# Altium schematic sheet VOLTAGE REGULATOR.SchDoc
size A4; SheetNumber: 5; SheetTotal: 8
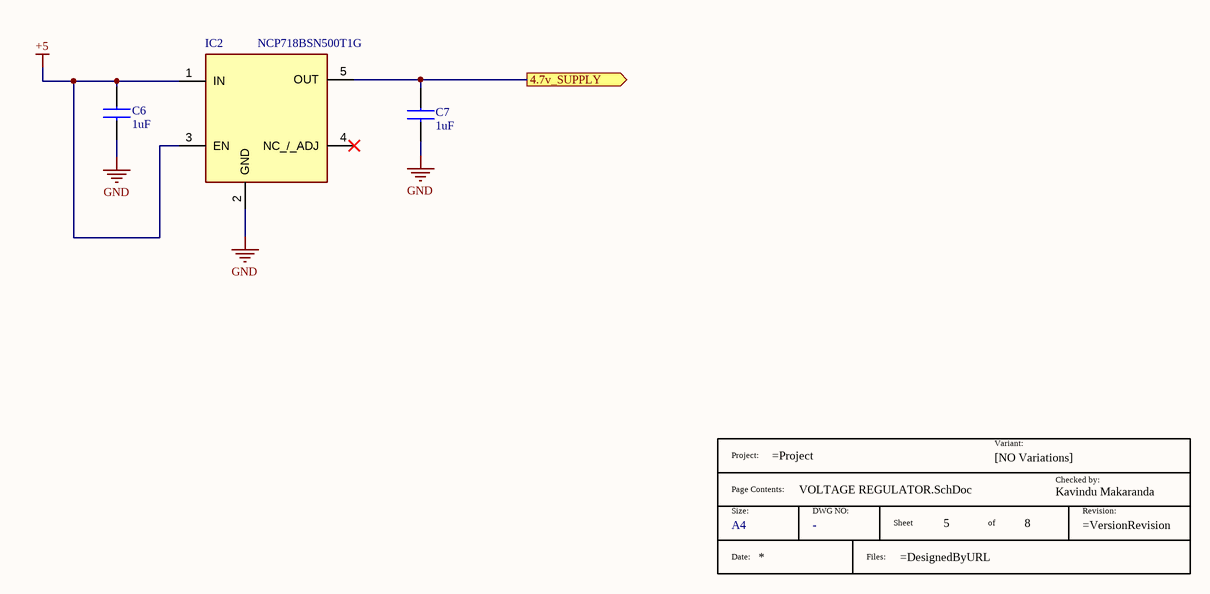
[diagram p0: VOLTAGE REGULATOR.SchDoc]

## Parts
*?  Size: A4  (hidden comment: TitleBlock)  (graphical)
C6  1uF  [CAPC1608X90N]
C7  1uF  [CAPC1608X90N]
IC2  NCP718BSN500T1G  [SOT95P280X100-5N]

## Ports
4.7v_SUPPLY (out, see Main_sch[2B], DISPLAY[2C], FUEL GAUGE IC[1B], MCU[3A])

## Nets
+5: C6.2 IC2.1(IN) IC2.3(EN)
GND: C6.1 C7.1 IC2.2(GND)
4.7v_SUPPLY: C7.2 IC2.5(OUT) ; port 4.7v_SUPPLY

Not connected (* = marked no-connect by the designer): IC2 4(NC_/_ADJ)*

## Notes on the sheet
- THIS DOCUMENT AND THE DATA DISCLOSED HEREIN OR
- HEREWITH IS THE PROPERTY OF ALTIUM LIMITED AND MAY
- DWG NO:
- REVISION
- REV:
- DESCRIPTION
- DATE
- APPROVED
- BE FREELY DISTRIBUTED IN WHOLE. NO RIGHTS ARE
- RESERVED OR EXPRESS OR IMPLIED WARANTEE GIVEN.
- ENG:
- APPROVALS
- PROJECT
- DSN:
- CHK:
- REFERENCE DOCUMENTS
- PROJECT REVISION:
- TITLE
- DOCUMENT REVISION:
- DESIGN ITEM:
- BOM:
- FAB DWG:
- PCB DWG:
- ASSY DWG:
- SCALE:
- A3
- SIZE
- CAGE CODE
- FILE NAME
- DWG NO.
- SHEET
- OF
- REV
- (in symbol TitleBlock) Project:; Variant:; [NO Variations]; Checked by:; Page Contents:; Kavindu Makaranda; Size:; DWG NO:; Sheet; of; Revision:; Date:; Files:

## Library data of the parts
*? = TitleBlock: Standard Title Block; DWG NO: -
C6 C7 = CL10A105KO8NNNC: Manufacturer_Name: SAMSUNG; Datasheet Link: https://labcenter.componentsearchengine.com/Datasheets/2/CL10A105KO8NNNC.pdf; Height: 0.9mm; Manufacturer_Part_Number: CL10A105KO8NNNC; Mouser Part Number: 187-CL10A105KO8NNNC; Mouser Price/Stock: https://www.mouser.co.uk/ProductDetail/Samsung-Electro-Mechanics/CL10A105KO8NNNC?qs=hqM3L16%252BxlfR4qamq4FMLg%3D%3D; Arrow Part Number: CL10A105KO8NNNC; Arrow Price/Stock: https://www.arrow.com/en/products/cl10a105ko8nnnc/samsung-electro-mechanics?utm_currency=USD&region=nac; Supplier 1: Digikey; Supplier Part Number 1: 1276-1034-1-ND
IC2 = NCP718BSN500T1G: Integrated Circuit; Manufacturer_Name: onsemi; Datasheet Link: https://www.onsemi.com/pub/Collateral/NCP718-D.PDF; Height: 1mm; Manufacturer_Part_Number: NCP718BSN500T1G; Mouser Part Number: 863-NCP718BSN500T1G; Mouser Price/Stock: https://www.mouser.co.uk/ProductDetail/onsemi/NCP718BSN500T1G?qs=MLItCLRbWsy0K4chDaw%252BGA%3D%3D; Arrow Part Number: NCP718BSN500T1G; Arrow Price/Stock: https://www.arrow.com/en/products/ncp718bsn500t1g/on-semiconductor?region=nac; Supplier 1: Arrow Electronics; Supplier Part Number 1: NCP718BSN500T1G